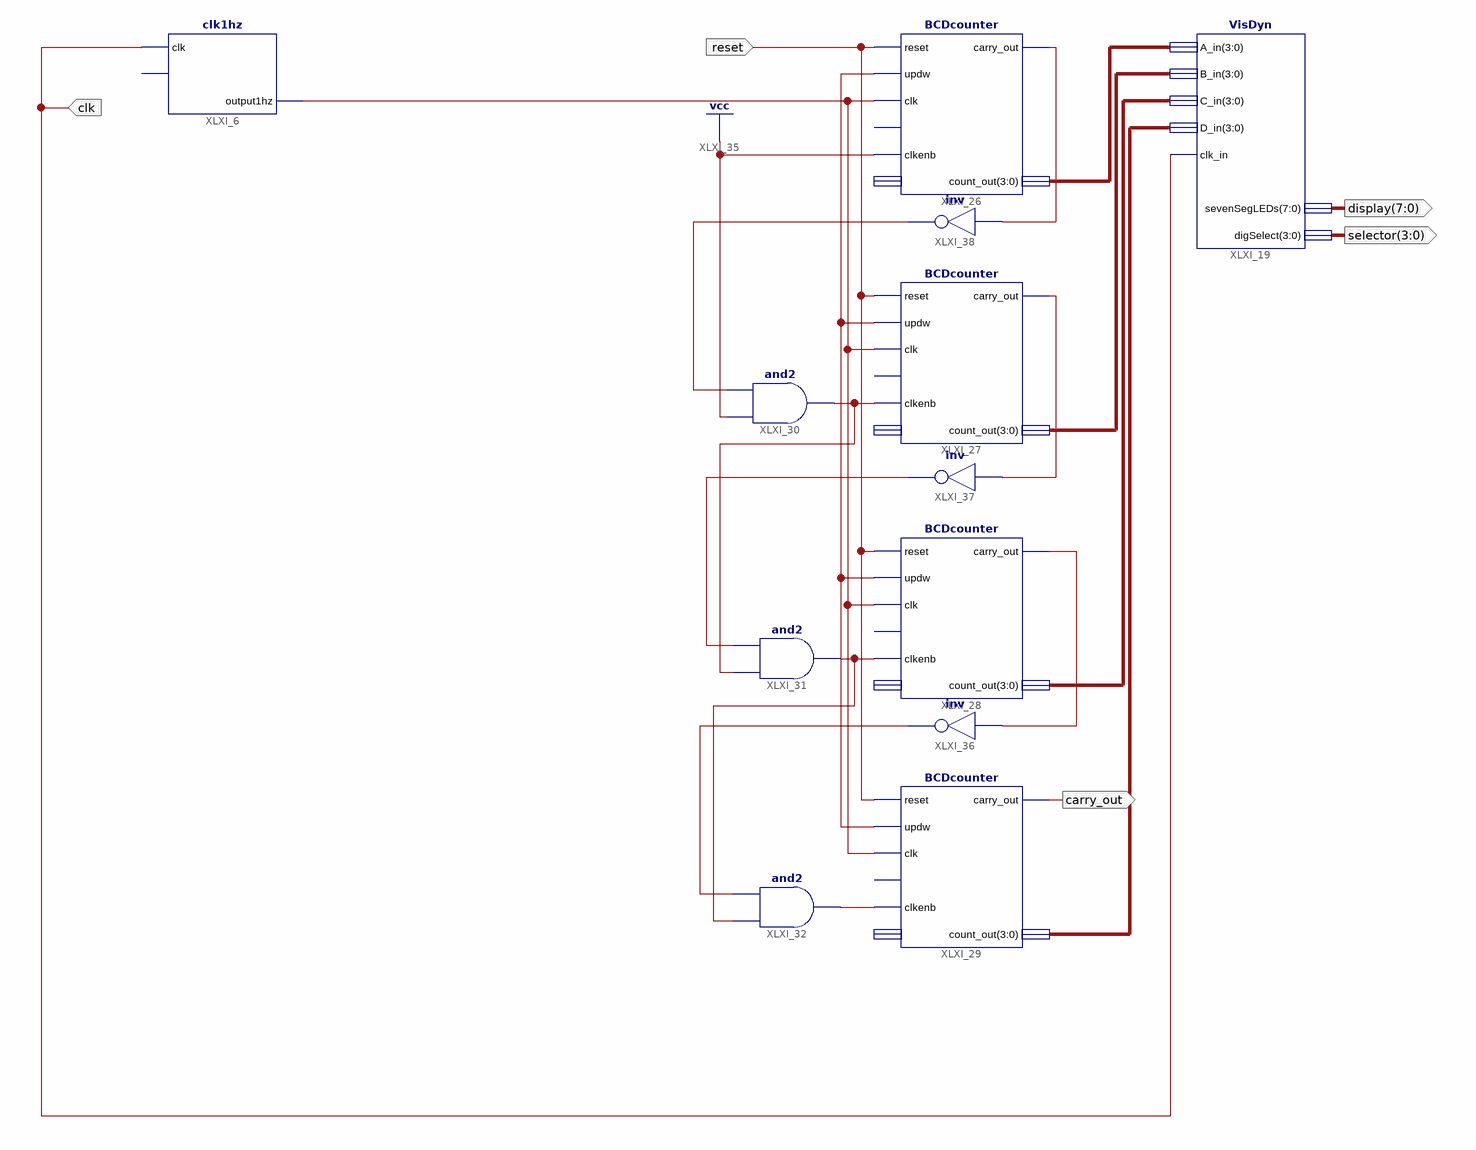
[diagram p0: schematic sheet 1]
// Xilinx ISE schematic top.sch (spartan3e) as structural Verilog: 12 symbols, 5 ports
module top (
  input  clk,
  input  reset,
  output [7:0] display,
  output [3:0] selector,
  output carry_out
);

  wire XLXN_56, XLXN_57, XLXN_58, XLXN_61, XLXN_64, XLXN_78, XLXN_79, XLXN_80, XLXN_81, XLXN_83, XLXN_84;
  wire [3:0] XLXN_52, XLXN_53, XLXN_54, XLXN_55;

  clk1hz XLXI_6 (.clk(clk), .output1hz(XLXN_64));  // open: reset
  VisDyn XLXI_19 (
    .A_in(XLXN_52), .B_in(XLXN_53), .C_in(XLXN_54), .D_in(XLXN_55), .clk_in(clk), .sevenSegLEDs(display),
    .digSelect(selector));
  BCDcounter XLXI_26 (
    .reset(reset), .updw(XLXN_61), .clk(XLXN_64), .clkenb(1'b1), .carry_out(XLXN_84), .count_out(XLXN_52));  // open: loadenb, load_in
  BCDcounter XLXI_27 (
    .reset(reset), .updw(XLXN_61), .clk(XLXN_64), .clkenb(XLXN_58), .carry_out(XLXN_81), .count_out(XLXN_53));  // open: loadenb, load_in
  BCDcounter XLXI_28 (
    .reset(reset), .updw(XLXN_61), .clk(XLXN_64), .clkenb(XLXN_57), .carry_out(XLXN_78), .count_out(XLXN_54));  // open: loadenb, load_in
  BCDcounter XLXI_29 (
    .reset(reset), .updw(XLXN_61), .clk(XLXN_64), .clkenb(XLXN_56), .carry_out(carry_out), .count_out(XLXN_55));  // open: loadenb, load_in
  and XLXI_30 (XLXN_58, 1'b1, XLXN_83);
  and XLXI_31 (XLXN_57, XLXN_58, XLXN_80);
  and XLXI_32 (XLXN_56, XLXN_57, XLXN_79);
  not XLXI_36 (XLXN_79, XLXN_78);
  not XLXI_37 (XLXN_80, XLXN_81);
  not XLXI_38 (XLXN_83, XLXN_84);
endmodule
